# Altium schematic sheet SCH.SchDoc: =GlobalProjectName
size 594 x 420 mm; CheckedBy: A_D; Author: A_D; SheetTotal: 1; PageSetup: Record=PageOptions|CenterHorizontal=True|CenterVertical=True|PrintScale=0.70|XCorrection=1.00|YCorrection=1.00|PrintKind=2|BorderSize=5000000|LeftOffset=9000|BottomOffset=10100|Orientation=2|PaperLength=11176|PaperWidth=8636|Scale=100|PaperSource=259|PrintQuality=-3|MediaType=1|DitherType=10|PrintScaleMode=1|PaperKind=A3|PaperIndex=8
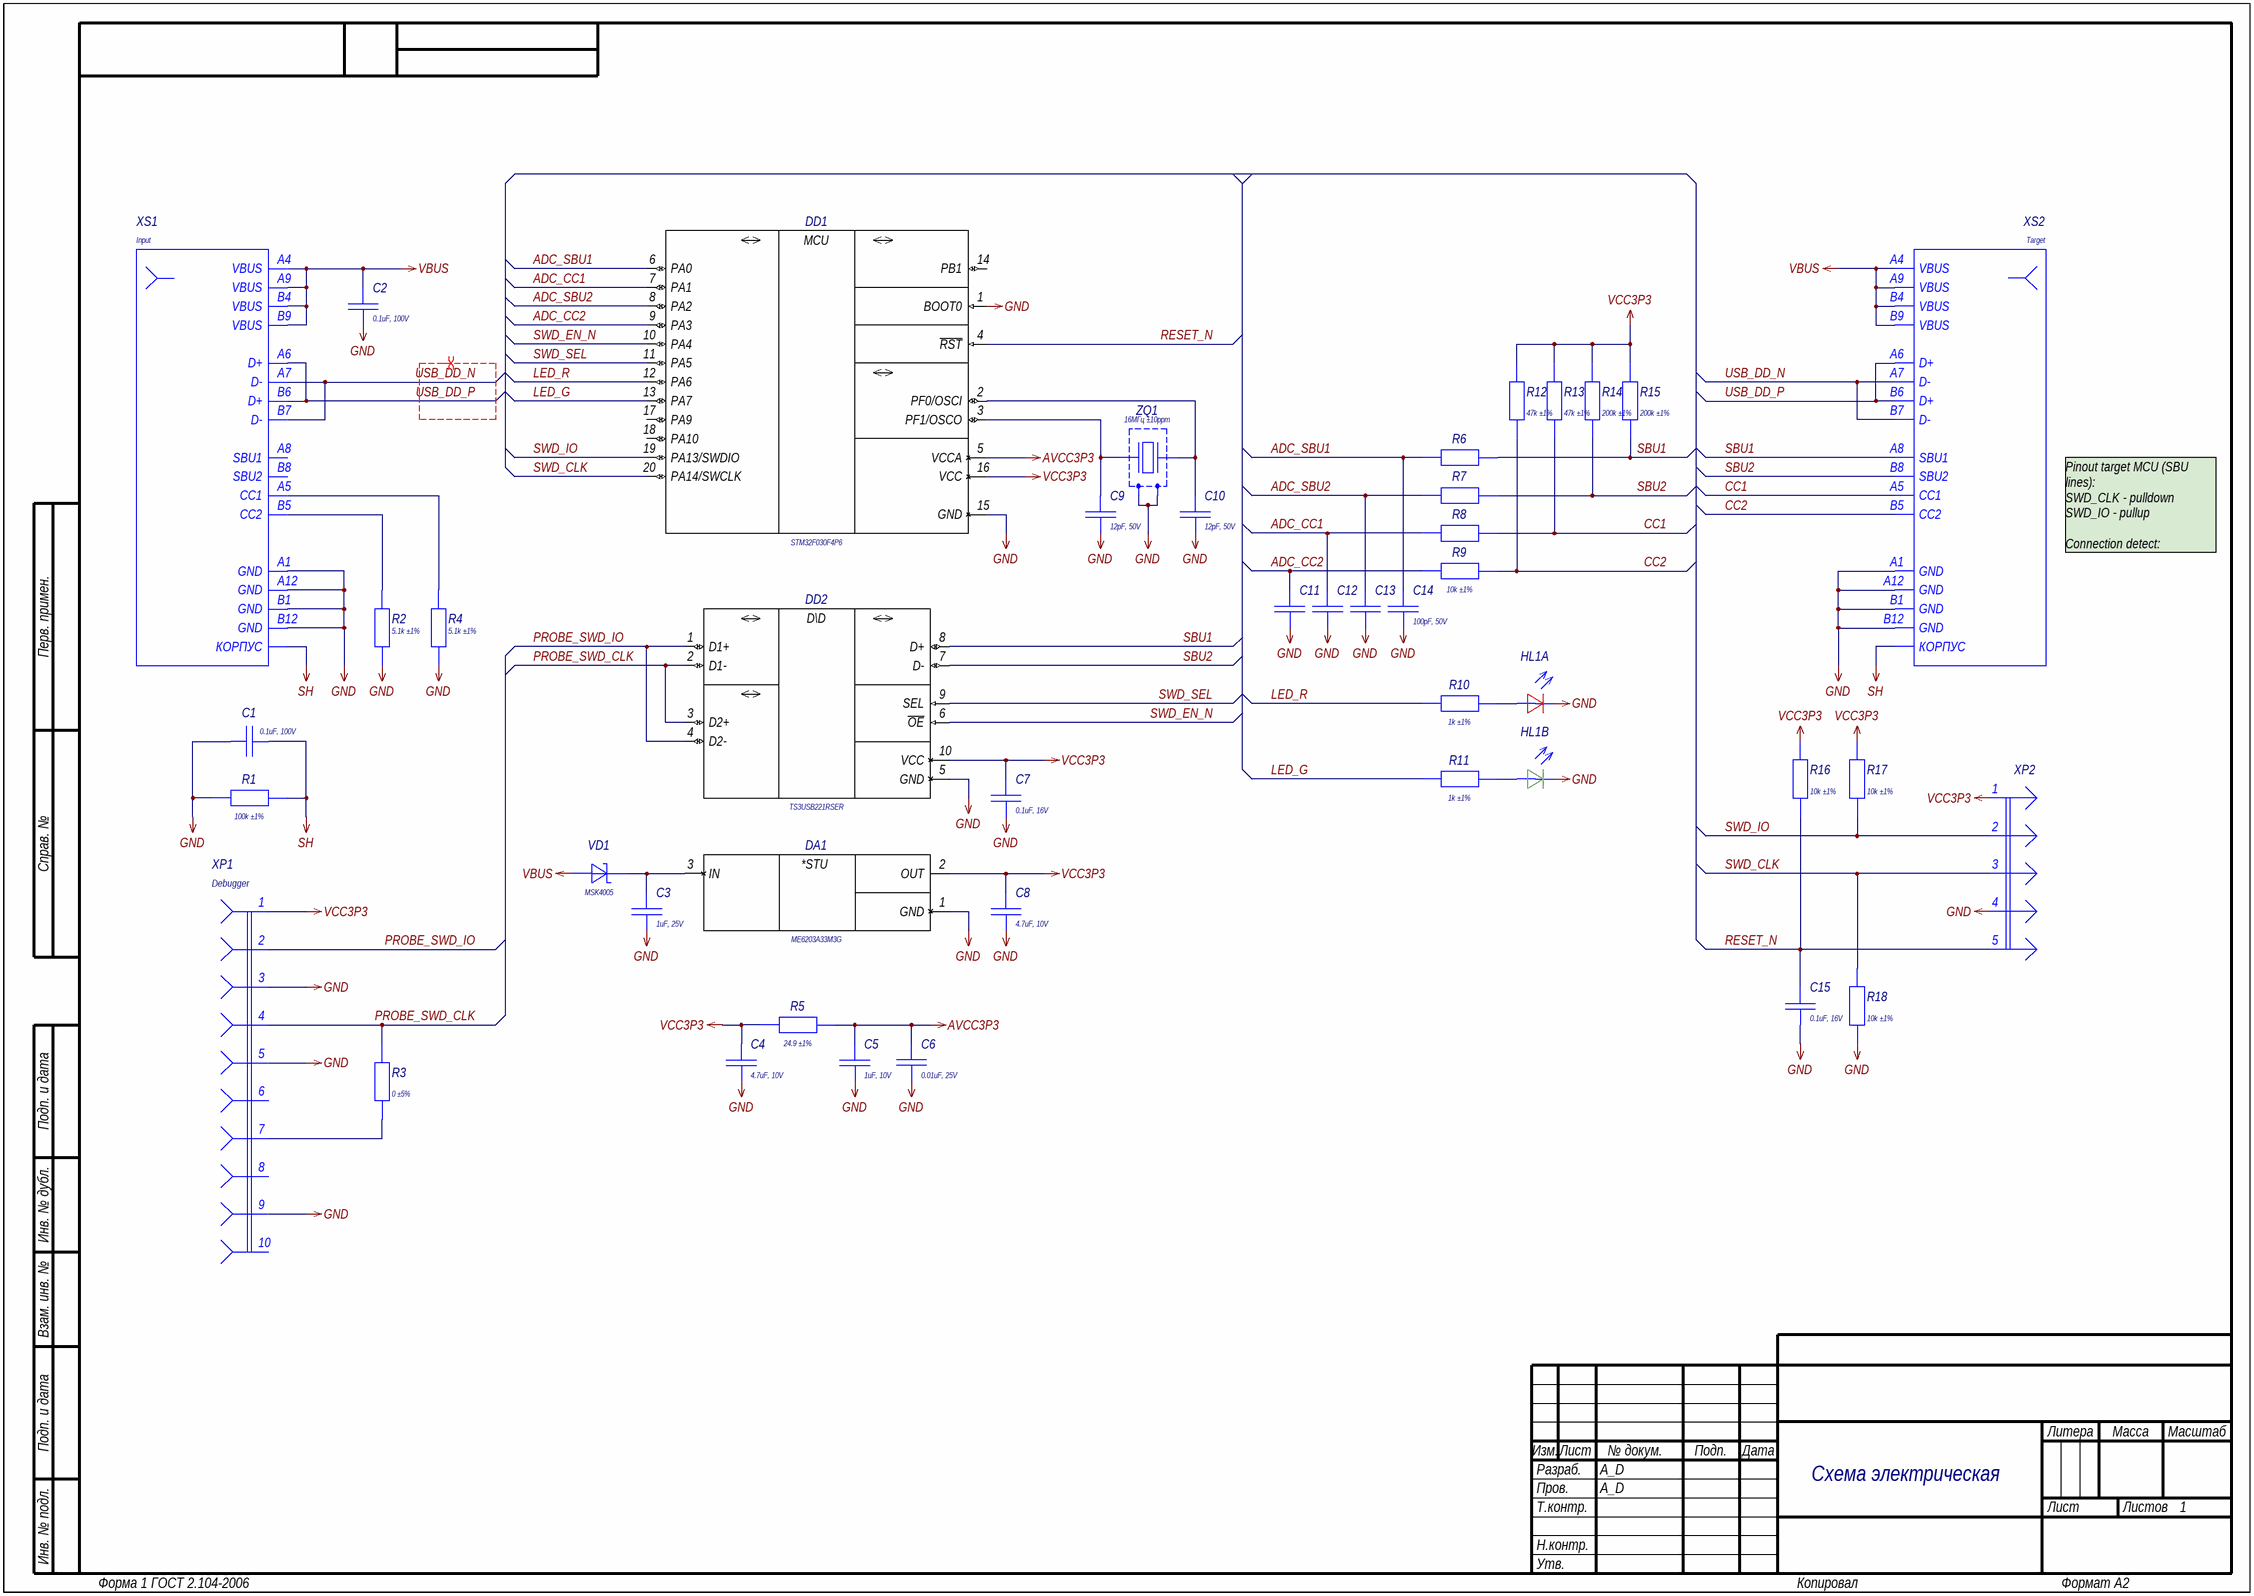
[diagram p0: SCH.SchDoc]

## Parts
C1  Schematic Value: 0.1uF, 100V  [C0603_160X080H080_H]  (hidden comment: Capacitor)
C2  Schematic Value: 0.1uF, 100V  [C0603_160X080H080_H]  (hidden comment: Capacitor)
C3  Schematic Value: 1uF, 25V  [C0603_160X080H080_H]  (hidden comment: Capacitor)
C4  Schematic Value: 4.7uF, 10V  [C0402_100X050H050_H]  (hidden comment: Capacitor)
C5  Schematic Value: 1uF, 10V  [C0402_100X050H050_H]  (hidden comment: Capacitor)
C6  Schematic Value: 0.01uF, 25V  [C0402_100X050H050_H]  (hidden comment: Capacitor)
C7  Schematic Value: 0.1uF, 16V  [C0402_100X050H050_H]  (hidden comment: Capacitor)
C8  Schematic Value: 4.7uF, 10V  [C0402_100X050H050_H]  (hidden comment: Capacitor)
C9  Schematic Value: 12pF, 50V  [C0402_100X050H050_H]  (hidden comment: Capacitor)
C10  Schematic Value: 12pF, 50V  [C0402_100X050H050_H]  (hidden comment: Capacitor)
C11  Capacitor  [C0402_100X050H050_H]  (value not drawn)
C12  Capacitor  [C0402_100X050H050_H]  (value not drawn)
C13  Capacitor  [C0402_100X050H050_H]  (value not drawn)
C14  Schematic Value: 100pF, 50V  [C0402_100X050H050_H]  (hidden comment: Capacitor)
C15  Schematic Value: 0.1uF, 16V  [C0402_100X050H050_H]  (hidden comment: Capacitor)
DA1  Schematic Value: ME6203A33M3G  [SOT-23_190P290X160X145_N]  (hidden comment: ME6203Axx-Series)
DD1  Schematic Value: STM32F030F4P6  [TSSOP-20_065P650X440X120_N]  (hidden comment: STM32F030FxPx-Series)
DD2  Schematic Value: TS3USB221RSER  [UQFN-10_050P200X150X060_N]  (hidden comment: TS3USB221RSE)
HL1  Text  [LD3025]  (value not drawn)  (parts A,B of 2)
R1  Schematic Value: 100k ±1%  [R0402_100X050H035_H]  (hidden comment: Resistor)
R2  Schematic Value: 5.1k ±1%  [R0402_100X050H035_H]  (hidden comment: Resistor)
R3  Schematic Value: 0 ±5%  [R0402_100X050H035_H]  (hidden comment: Resistor)
R4  Schematic Value: 5.1k ±1%  [R0402_100X050H035_H]  (hidden comment: Resistor)
R5  Schematic Value: 24.9 ±1%  [R0402_100X050H035_H]  (hidden comment: Resistor)
R6  Resistor  [R0402_100X050H035_H]  (value not drawn)
R7  Resistor  [R0402_100X050H035_H]  (value not drawn)
R8  Resistor  [R0402_100X050H035_H]  (value not drawn)
R9  Schematic Value: 10k ±1%  [R0402_100X050H035_H]  (hidden comment: Resistor)
R10  Schematic Value: 1k ±1%  [R0402_100X050H035_H]  (hidden comment: Resistor)
R11  Schematic Value: 1k ±1%  [R0402_100X050H035_H]  (hidden comment: Resistor)
R12  Schematic Value: 47k ±1%  [R0402_100X050H035_H]  (hidden comment: Resistor)
R13  Schematic Value: 47k ±1%  [R0402_100X050H035_H]  (hidden comment: Resistor)
R14  Schematic Value: 200k ±1%  [R0402_100X050H035_H]  (hidden comment: Resistor)
R15  Schematic Value: 200k ±1%  [R0402_100X050H035_H]  (hidden comment: Resistor)
R16  Schematic Value: 10k ±1%  [R0402_100X050H035_H]  (hidden comment: Resistor)
R17  Schematic Value: 10k ±1%  [R0402_100X050H035_H]  (hidden comment: Resistor)
R18  Schematic Value: 10k ±1%  [R0402_100X050H035_H]  (hidden comment: Resistor)
VD1  Schematic Value: MSK4005  [SOD-523]  (hidden comment: Schottky)
XP1  Debugger  [PBD-10]
XP2  SWD  [PLS-5]  (value not drawn)  (no BOM)
XS1  Input  [U262-161N-4BVC11]
XS2  Target  [U262-161N-4BVC11]
ZQ1  Schematic Value: 16МГц ±10ppm  [SMD 3.2x2.5mm]  (hidden comment: Crystal-1_3p_S)

## Nets
AVCC3P3: C5.2 C6.1 DD1.5(VCCA) R5.1
GND: C1.2 C2.1 C3.1 C4.1 C5.1 C6.2 C7.1 C8.1 C9.1 C10.1 C11.1 C12.1 C13.1 C14.1 C15.1 DA1.1(GND) DD1.1(BOOT0) DD1.15(GND) DD2.5(GND) HL1.2 HL1.4 R1.2 R2.1 R4.1 R18.2 XP1.3 XP1.5 XP1.9 XP2.4 XS1.A1(GND) XS1.A12(GND) XS1.B1(GND) XS1.B12(GND) XS2.A1(GND) XS2.A12(GND) XS2.B1(GND) XS2.B12(GND) ZQ1.2 ZQ1.4
SH: C1.1 R1.1 XS1.SH(КОРПУС) XS2.SH(КОРПУС)
VBUS: C2.2 VD1.1(А) XS1.A4(VBUS) XS1.A9(VBUS) XS1.B4(VBUS) XS1.B9(VBUS) XS2.A4(VBUS) XS2.A9(VBUS) XS2.B4(VBUS) XS2.B9(VBUS)
VCC3P3: C4.2 C7.2 C8.2 DA1.2(OUT) DD1.16(VCC) DD2.10(VCC) R5.2 R12.2 R13.2 R14.2 R15.2 R16.1 R17.1 XP1.1 XP2.1
ADC_CC1: C12.2 DD1.7(PA1) R8.2
ADC_CC2: C11.2 DD1.9(PA3) R9.2
ADC_SBU1: C14.2 DD1.6(PA0) R6.2
ADC_SBU2: C13.2 DD1.8(PA2) R7.2
CC1: R8.1 R13.1 XS2.A5(CC1)
CC2: R9.1 R12.1 XS2.B5(CC2)
LED_G: DD1.13(PA7) R11.2
LED_R: DD1.12(PA6) R10.2
PROBE_SWD_CLK: DD2.2(D1-) DD2.3(D2+) R3.1 XP1.4
PROBE_SWD_IO: DD2.1(D1+) DD2.4(D2-) XP1.2
RESET_N: C15.2 DD1.4(~{RST}) R16.2 XP2.5
SBU1: DD2.8(D+) R6.1 R15.1 XS2.A8(SBU1)
SBU2: DD2.7(D-) R7.1 R14.1 XS2.B8(SBU2)
SWD_CLK: DD1.20(PA14/SWCLK) R18.1 XP2.3
SWD_EN_N: DD1.10(PA4) DD2.6(~{OE})
SWD_IO: DD1.19(PA13/SWDIO) R17.2 XP2.2
SWD_SEL: DD1.11(PA5) DD2.9(SEL)
USB_DD_N: XS1.A7(D-) XS1.B7(D-) XS2.A7(D-) XS2.B7(D-)
USB_DD_P: XS1.A6(D+) XS1.B6(D+) XS2.A6(D+) XS2.B6(D+)
NetC3_2: C3.2 DA1.3(IN) VD1.2(К)
NetC9_2: C9.2 DD1.3(PF1/OSCO) ZQ1.1
NetC10_2: C10.2 DD1.2(PF0/OSCI) ZQ1.3
NetHL1_1: HL1.1 R10.1
NetHL1_3: HL1.3 R11.1
NetR2_2: R2.2 XS1.B5(CC2)
NetR3_2: R3.2 XP1.7
NetR4_2: R4.2 XS1.A5(CC1)

Not connected (* = marked no-connect by the designer): DD1 14(PB1) 17(PA9) 18(PA10); XP1 6 8 10; XS1 A8(SBU1) B8(SBU2)

## Layout directives
differential pair: USB_DD_N, USB_DD_P

## Notes on the sheet
- Pinout target MCU (SBU lines):
  SWD_CLK - pulldown
  SWD_IO - pullup
  Connection detect:
  CC1\CC2 - pulldown
- Схема электрическая
  принципиальная
- Перв. примен.
- Справ. №
- Подп. и дата
- Инв. № дубл.
- Взам. инв. №
- Разраб.
- Изм.
- Лист
- № докум.
- Подп.
- Дата
- Литера
- Масса
- Масштаб
- Пров.
- Т.контр.
- Листов
- Инв. № подл.
- Н.контр.
- Утв.
- Форма 1 ГОСТ 2.104-2006
- Копировал
- Формат А2
- (in symbol ME6203A33M3G) *STU
- (in symbol STM32F030F4P6) MCU
- (in symbol TS3USB221RSER) D\D

## Library data of the parts
C1 = GRM188R72A104KA35D: Manufacturer: Murata; ID: 232; Value: 0.1uF; Voltage: 100V; Tolerance: ±10%; Dielectric Type: X7R; Functional Analog: GRM188R72A104KA35J; AEC Standard: General; Part Number: GRM188R72A104KA35D; Footprint: 0603; LCSC Part: C113803; Temperature Min: -55°С; Temperature Max: +125°С; Part Type: Конденсатор; ClassName: DC
C2 = GRM188R72A104KA35D: Manufacturer: Murata; ID: 232; Value: 0.1uF; Voltage: 100V; Tolerance: ±10%; Dielectric Type: X7R; AEC Standard: General; Functional Analog: GRM188R72A104KA35J; Part Number: GRM188R72A104KA35D; Footprint: 0603; LCSC Part: C113803; Temperature Min: -55°С; Temperature Max: +125°С; Part Type: Конденсатор; ClassName: DC
C3 = GCM188R71E105KA64D: Manufacturer: Murata; ID: 134; Value: 1uF; Voltage: 25V; Tolerance: ±10%; Dielectric Type: X7R; Functional Analog: GCM188R71E105KA64J; AEC Standard: AEC-Q200; Part Number: GCM188R71E105KA64D; Footprint: 0603; LCSC Part: C85862; Temperature Min: -55°С; Temperature Max: +125°С; Part Type: Конденсатор; ClassName: DC
C4 C8 = GRM155R61A475MEAAD: Manufacturer: Murata; ID: 255; Value: 4.7uF; Voltage: 10V; Tolerance: ±20%; Dielectric Type: X5R; Functional Analog: GRM155R61A475MEAAJ; AEC Standard: General; Part Number: GRM155R61A475MEAAD; Footprint: 0402; LCSC Part: C335105; Temperature Min: -55°С; Temperature Max: +85°С; Part Type: Конденсатор
  C8: ClassName: DC
C5 = GRM155C71A105KE11D: Manufacturer: Murata; ID: 179; Value: 1uF; Voltage: 10V; Tolerance: ±10%; Dielectric Type: X7S; Functional Analog: GRM155C71A105KE11J; AEC Standard: General; Part Number: GRM155C71A105KE11D; Footprint: 0402; LCSC Part: C437522; Temperature Min: -55°С; Temperature Max: +125°С; Part Type: Конденсатор
C6 = GCM155R71E103KA37D: Manufacturer: Murata; ID: 150; Value: 0.01uF; Voltage: 25V; Tolerance: ±10%; Dielectric Type: X7R; Functional Analog: GRM155R71E103KA01D, GCM155R71E103KA37J, GCM155R71E103KA37W; AEC Standard: AEC-Q200; Part Number: GCM155R71E103KA37D; Footprint: 0402; LCSC Part: C126526; Temperature Min: -55°С; Temperature Max: +125°С; Part Type: Конденсатор
C7 C15 = GCM155R71C104KA55D: Manufacturer: Murata; ID: 163; Value: 0.1uF; Voltage: 16V; Tolerance: ±10%; Dielectric Type: X7R; Functional Analog: GRM155R71C104KA88D, GCM155R71C104KA55J, GCM155R71C104KA55W; AEC Standard: AEC-Q200; Part Number: GCM155R71C104KA55D; Footprint: 0402; LCSC Part: C85857; Temperature Min: -55°С; Temperature Max: +125°С; Part Type: Конденсатор
C9 C10 = GRM1555C1H120JA01D: Manufacturer: Murata; ID: 159; Value: 12pF; Voltage: 50V; Tolerance: ±5%; Dielectric Type: NP0; Functional Analog: GJM1555C1H120GB01D, GRM1555C1H120JA01J, GRM1555C1H120JA01W; AEC Standard: General; Part Number: GRM1555C1H120JA01D; Footprint: 0402; LCSC Part: C76948; Temperature Min: -55°С; Temperature Max: +125°С; Part Type: Конденсатор
C11-C13 = GCM1555C1H101FA16D: Manufacturer: Murata; ID: 164; Value: 100pF; Voltage: 50V; Tolerance: ±1%; Dielectric Type: NP0; Functional Analog: GRM1555C1H101JA01D, GCM1555C1H101FA16J, GCM1555C1H101FA16W; AEC Standard: AEC-Q200; Schematic Value: 100pF, 50V; Part Number: GCM1555C1H101FA16D; Footprint: 0402; LCSC Part: C2941926; Temperature Min: -55°С; Temperature Max: +125°С; Part Type: Конденсатор
C14 = GCM1555C1H101FA16D: Manufacturer: Murata; ID: 164; Value: 100pF; Voltage: 50V; Tolerance: ±1%; Dielectric Type: NP0; Functional Analog: GRM1555C1H101JA01D, GCM1555C1H101FA16J, GCM1555C1H101FA16W; AEC Standard: AEC-Q200; Part Number: GCM1555C1H101FA16D; Footprint: 0402; LCSC Part: C2941926; Temperature Min: -55°С; Temperature Max: +125°С; Part Type: Конденсатор
DA1 = ME6203A33M3G: Manufacturer: Nanjing Micro One Elec; ID: 45; Input Voltage: +3.0…40.0V; Output Current: 0.1A; Output Voltage: +3.3V; Total Power Dissipation: 0.3W; Functional Analog: HT7533S; Part Number: ME6203A33M3G; Value: ME6203A33M3G; LCSC Part: C87842; Temperature Min: -45°С; Temperature Max: +150°С; Part Type: Микросхема; ClassName: DC
DD1 = STM32F030F4P6: Manufacturer: STMicroelectronics; ID: 46; Supply Operation: +2.4…3.6V; ROM: 16K; RAM: 4K; Prog Interface: SWD; IO Lines: 15; Operation Frequency: 48MHz; Part Number: STM32F030F4P6; Value: STM32F030F4P6; LCSC Part: C32908; Temperature Min: -40°С; Temperature Max: +85°С; Part Type: Микросхема
DD2 = TS3USB221RSER: Manufacturer: Texas Instruments; ID: 20; Supply Operation: +2.3…3.6V; Supply Current: 30uA; USB Type Support: USB 2.0; USB Speed Support: 480 Mb/s; OTG Support: No; Input Interface: LVDS; Channels: 1; Part Number: TS3USB221RSER; Value: TS3USB221RSER; LCSC Part: C130085; Temperature Min: -40°C; Temperature Max: +85°C; Part Type: Микросхема
HL1 = XL-3227SURUGC: Manufacturer: XINGLIGHT; Type: Сборка индикаторная; ID: 46; Forward Voltage: 2.5/2.5V; Forward Current: 30mA; Power Dissipation: 75/75mW; Color: Red, Green; Leds: 2; Published: 04.02.2017; Publisher: Andrew Danich; Part Number: XL-3227SURUGC; Value: XL-3227SURUGC; Footprint: 3025; LCSC Part: C965842; Temperature Min: -30°С; Temperature Max: +85°С; Schematic Value: XL-3227SURUGC; Part Type: Светодиодная сборка
R1 = 0402WGF1003TCE: Manufacturer: Uniroyal Elec; ID: 661; Value: 100k; Limit Voltage: 50V; Tolerance: ±1%; Temperature Coefficient: 100ppm; Total Power Dissipation: 0.1W; Series Type: Thick-Film; Part Number: 0402WGF1003TCE; Footprint: 0402; Temperature Min: -55°С; Temperature Max: +155°С; Part Type: Резистор; LCSC Part: C25741; ClassName: DC
R2 R4 = 0402WGF5101TCE: Manufacturer: Uniroyal Elec; ID: 667; Value: 5.1k; Limit Voltage: 50V; Tolerance: ±1%; Temperature Coefficient: 100ppm; Total Power Dissipation: 0.1W; Series Type: Thick-Film; Part Number: 0402WGF5101TCE; Footprint: 0402; Temperature Min: -55°С; Temperature Max: +155°С; Part Type: Резистор; LCSC Part: C25905
R3 = RC0402JR-070RL: Manufacturer: Yageo; ID: 362; Value: 0; Limit Voltage: 50V; Tolerance: ±5%; Temperature Coefficient: 100ppm; Total Power Dissipation: 0.1W; Series Type: Thick-Film; Part Number: RC0402JR-070RL; Footprint: 0402; Temperature Min: -55°С; Temperature Max: +155°С; Part Type: Резистор
R5 = RC0402FR-0724R9L: Manufacturer: Yageo; ID: 543; Value: 24.9; Limit Voltage: 50V; Tolerance: ±1%; Temperature Coefficient: 100ppm; Total Power Dissipation: 0.1W; Series Type: Thick-Film; Part Number: RC0402FR-0724R9L; Footprint: 0402; Temperature Min: -55°С; Temperature Max: +155°С; Part Type: Резистор
R6-R8 = 0402WGF1002TCE: Manufacturer: Uniroyal Elec; ID: 665; Value: 10k; Limit Voltage: 50V; Tolerance: ±1%; Temperature Coefficient: 100ppm; Total Power Dissipation: 0.1W; Series Type: Thick-Film; Schematic Value: 10k ±1%; Part Number: 0402WGF1002TCE; Footprint: 0402; Temperature Min: -55°С; Temperature Max: +155°С; Part Type: Резистор; LCSC Part: C25744
R9 R16-R18 = 0402WGF1002TCE: Manufacturer: Uniroyal Elec; ID: 665; Value: 10k; Limit Voltage: 50V; Tolerance: ±1%; Temperature Coefficient: 100ppm; Total Power Dissipation: 0.1W; Series Type: Thick-Film; Part Number: 0402WGF1002TCE; Footprint: 0402; Temperature Min: -55°С; Temperature Max: +155°С; Part Type: Резистор; LCSC Part: C25744
R10 R11 = 0402WGF1001TCE: Manufacturer: Uniroyal Elec; ID: 663; Value: 1k; Limit Voltage: 50V; Tolerance: ±1%; Temperature Coefficient: 100ppm; Total Power Dissipation: 0.1W; Series Type: Thick-Film; Part Number: 0402WGF1001TCE; Footprint: 0402; Temperature Min: -55°С; Temperature Max: +155°С; Part Type: Резистор; LCSC Part: C11702
R12 R13 = 0402WGF4702TCE: Manufacturer: Uniroyal Elec; ID: 668; Value: 47k; Limit Voltage: 50V; Tolerance: ±1%; Temperature Coefficient: 100ppm; Total Power Dissipation: 0.1W; Series Type: Thick-Film; Part Number: 0402WGF4702TCE; Footprint: 0402; Temperature Min: -55°С; Temperature Max: +155°С; Part Type: Резистор; LCSC Part: C25792
R14 R15 = 0402WGF2003TCE: Manufacturer: Uniroyal Elec; ID: 676; Value: 200k; Limit Voltage: 50V; Tolerance: ±1%; Temperature Coefficient: 100ppm; Total Power Dissipation: 0.1W; Series Type: Thick-Film; Part Number: 0402WGF2003TCE; Footprint: 0402; Temperature Min: -55°С; Temperature Max: +155°С; Part Type: Резистор; LCSC Part: C25764
VD1 = MSK4005: Manufacturer: Shikues; ID: 26; Reverse Voltage: 50V; Reverse Current: 150uA; Forward Voltage: 0.49V; Forward Current: 500mA; Part Number: MSK4005; Value: MSK4005; LCSC Part: C345957; Temperature Min: -55°С; Temperature Max: +125°С; ClassName: DC
XP1 = PBD-10: ID: 20; Value: PBD-10; Limit Voltage: 250V; Limit Current: 3A; Connector Type: Female; Resistance: 15momh; Pitch: 2.54mm; Surface Finish: Gold; Part Number: PBD-10; Pins: 10; Schematic Value: PBD-10
XP2 = PLS-5: ID: 4; Value: PLS-5; Limit Voltage: 250V; Limit Current: 3A; Connector Type: Male; Resistance: 15momh; Surface Finish: Gold; Pitch: 2.54mm; Part Number: PLS-5; Pins: 5; Schematic Value: PLS-5
XS1 XS2 = U262-161N-4BVC11: Manufacturer: XKB Enterprise; ID: 41; Limit Voltage: 30V; Limit Current: 3A; Connector Type: Female; Interface: USB 3.1 Type C; Max Data Rate: 5 Gbps; Part Number: U262-161N-4BVC11; Value: U262-161N-4BVC11; Pins: 16; Mount Type: Surface; LCSC Part: C319148; Temperature Min: -40°С; Temperature Max: +85°С; Schematic Value: U262-161N-4BVC11; Part Type: Розетка; ClassName: DC
ZQ1 = X322516MOB4SI: Manufacturer: Yangxing Tech; ID: 39; Output Frequency: 16МГц; Shunt Capacitance: 7pF; Load Capacitance: 12pF; Temperature Coefficient: ±10ppm; Part Number: X322516MOB4SI; Value: X322516MOB4SI; LCSC Part: C12668; Temperature Min: -40°С; Temperature Max: +85°С; Part Type: Кварцевый резонатор